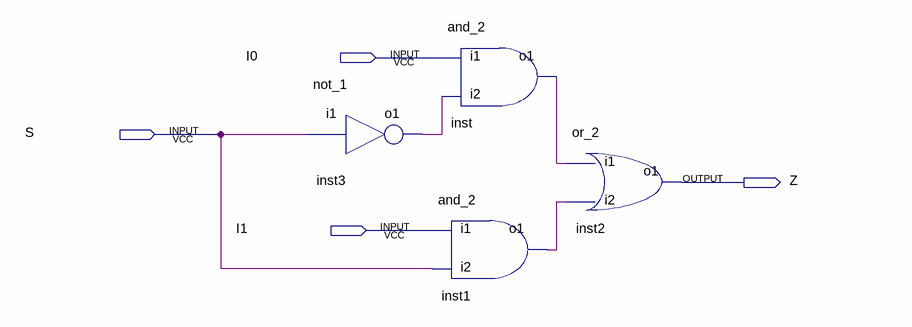
[diagram p0: schematic sheet]
// Quartus schematic MUX1.bdf as structural Verilog: 4 symbols, 4 pins
module MUX1 (
  input  I0,
  input  S,
  input  I1,
  output Z
);

  wire inst1_o1, inst3_o1, inst_o1;

  not_1 inst3 (.i1(S), .o1(inst3_o1));
  and_2 inst (.i1(I0), .i2(inst3_o1), .o1(inst_o1));
  and_2 inst1 (.i1(I1), .i2(S), .o1(inst1_o1));
  or_2 inst2 (.i1(inst_o1), .i2(inst1_o1), .o1(Z));
endmodule
